# EAGLE design BantiPai_eYSIP22 (EAGLE 9.6.1)
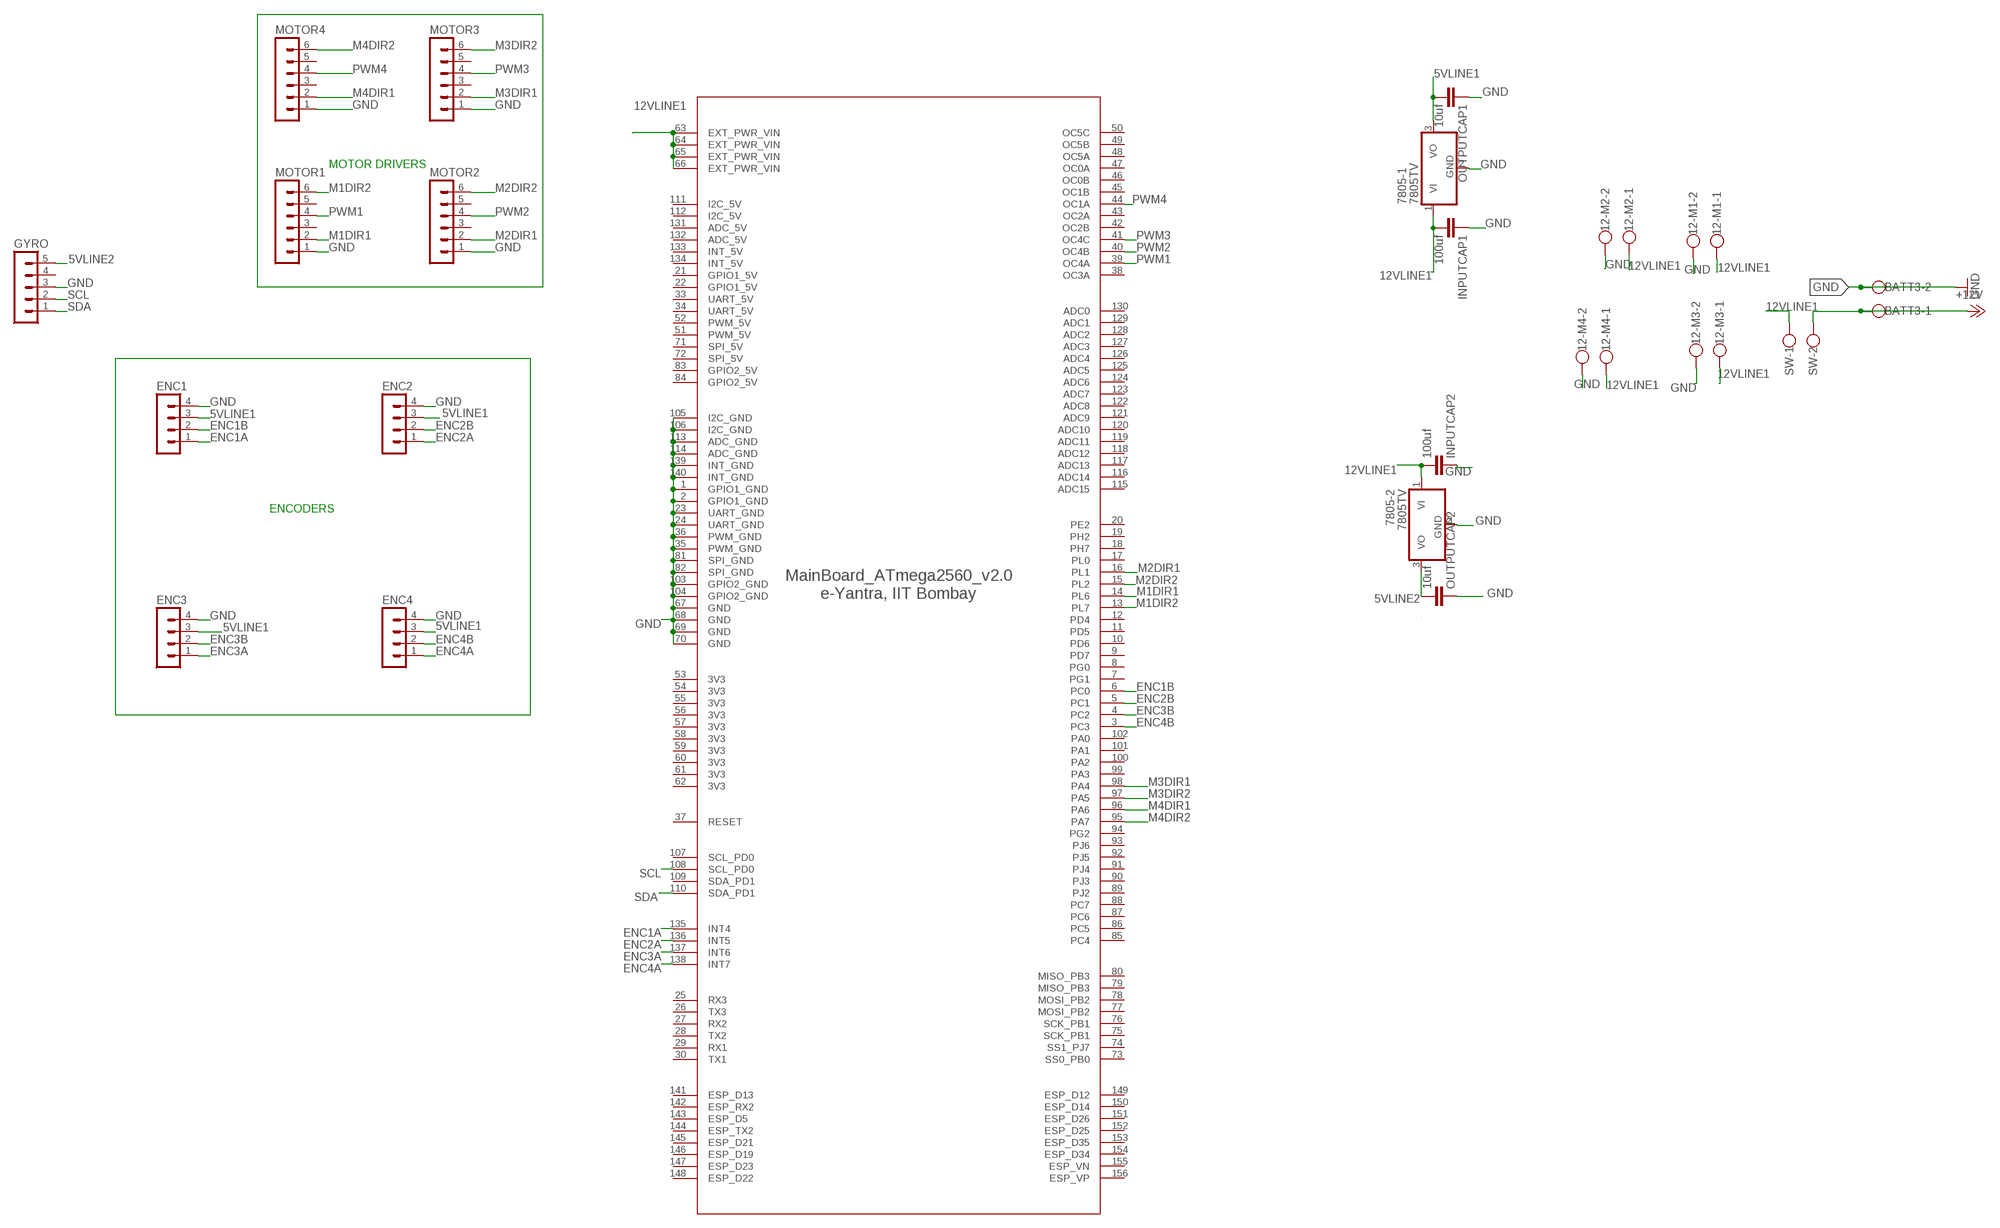
[diagram p0: schematic, sheet 1]

## Parts
12-M1  W237-102  [W237-102]
12-M2  W237-102  [W237-102]
12-M3  W237-102  [W237-102]
12-M4  W237-102  [W237-102]
7805-1  7805TV  [TO220V]
7805-2  7805TV  [TO220V]
BATT3  W237-102  [W237-102]
ENC1  MA04-1  [MA04-1]
ENC2  MA04-1  [MA04-1]
ENC3  MA04-1  [MA04-1]
ENC4  MA04-1  [MA04-1]
EYFI  ATMEGA2560_V2.0  [ATMEGA2560_V2.0]
GYRO  MA05-1  [MA05-1]
INPUTCAP1  100uf  C2.5/2  [C2.5-2]
INPUTCAP2  100uf  C2.5/2  [C2.5-2]
MOTOR1  MA06-1  [MA06-1]
MOTOR2  MA06-1  [MA06-1]
MOTOR3  MA06-1  [MA06-1]
MOTOR4  MA06-1  [MA06-1]
OUTPUTCAP1  10uf  C2.5/2  [C2.5-2]
OUTPUTCAP2  10uf  C2.5/2  [C2.5-2]
SW  W237-102  [W237-102]

## Nets
5VLINE1: 7805-1.3(VO) ENC1.3 ENC2.3 ENC3.3 ENC4.3 OUTPUTCAP1.2
5VLINE2: 7805-2.3(VO) GYRO.5 OUTPUTCAP2.2
12VLINE1 [twelvevolt]: 12-M1.1 12-M2.1 12-M3.1 12-M4.1 7805-1.1(VI) 7805-2.1(VI) EYFI.63(EXT_PWR_VIN) EYFI.64(EXT_PWR_VIN) EYFI.65(EXT_PWR_VIN) EYFI.66(EXT_PWR_VIN) INPUTCAP1.2 INPUTCAP2.2 SW.1
+12V: BATT3.1 SW.2
ENC1A: ENC1.1 EYFI.135(INT4)
ENC1B: ENC1.2 EYFI.6(PC0)
ENC2A: ENC2.1 EYFI.136(INT5)
ENC2B: ENC2.2 EYFI.5(PC1)
ENC3A: ENC3.1 EYFI.137(INT6)
ENC3B: ENC3.2 EYFI.4(PC2)
ENC4A: ENC4.1 EYFI.138(INT7)
ENC4B: ENC4.2 EYFI.3(PC3)
GND: 12-M1.2 12-M2.2 12-M3.2 12-M4.2 7805-1.2(GND) 7805-2.2(GND) BATT3.2 ENC1.4 ENC2.4 ENC3.4 ENC4.4 EYFI.1(GPIO1_GND) EYFI.2(GPIO1_GND) EYFI.23(UART_GND) EYFI.24(UART_GND) EYFI.35(PWM_GND) EYFI.36(PWM_GND) EYFI.67(GND) EYFI.68(GND) EYFI.69(GND) EYFI.70(GND) EYFI.81(SPI_GND) EYFI.82(SPI_GND) EYFI.103(GPIO2_GND) EYFI.104(GPIO2_GND) EYFI.105(I2C_GND) EYFI.106(I2C_GND) EYFI.113(ADC_GND) EYFI.114(ADC_GND) EYFI.139(INT_GND) EYFI.140(INT_GND) GYRO.3 INPUTCAP1.1 INPUTCAP2.1 MOTOR1.1 MOTOR2.1 MOTOR3.1 MOTOR4.1 OUTPUTCAP1.1 OUTPUTCAP2.1
M1DIR1: EYFI.14(PL6) MOTOR1.2
M1DIR2: EYFI.13(PL7) MOTOR1.6
M2DIR1: EYFI.16(PL1) MOTOR2.2
M2DIR2: EYFI.15(PL2) MOTOR2.6
M3DIR1: EYFI.98(PA4) MOTOR3.2
M3DIR2: EYFI.97(PA5) MOTOR3.6
M4DIR1: EYFI.96(PA6) MOTOR4.2
M4DIR2: EYFI.95(PA7) MOTOR4.6
PWM1: EYFI.39(OC4A) MOTOR1.4
PWM2: EYFI.40(OC4B) MOTOR2.4
PWM3: EYFI.41(OC4C) MOTOR3.4
PWM4: EYFI.44(OC1A) MOTOR4.4
SCL: EYFI.108(SCL_PD0) GYRO.2
SDA: EYFI.110(SDA_PD1) GYRO.1
Unconnected: EYFI.7(PG1) EYFI.8(PG0) EYFI.9(PD7) EYFI.10(PD6) EYFI.11(PD5) EYFI.12(PD4) EYFI.17(PL0) EYFI.18(PH7) EYFI.19(PH2) EYFI.20(PE2) EYFI.25(RX3) EYFI.26(TX3) EYFI.27(RX2) EYFI.28(TX2) EYFI.29(RX1) EYFI.30(TX1) EYFI.37(RESET) EYFI.38(OC3A) EYFI.42(OC2B) EYFI.43(OC2A) EYFI.45(OC1B) EYFI.46(OC0B) EYFI.47(OC0A) EYFI.48(OC5A) EYFI.49(OC5B) EYFI.50(OC5C) EYFI.73(SS0_PB0) EYFI.74(SS1_PJ7) EYFI.75(SCK_PB1) EYFI.76(SCK_PB1) EYFI.77(MOSI_PB2) EYFI.78(MOSI_PB2) EYFI.79(MISO_PB3) EYFI.80(MISO_PB3) EYFI.85(PC4) EYFI.86(PC5) EYFI.87(PC6) EYFI.88(PC7) EYFI.89(PJ2) EYFI.90(PJ3) EYFI.91(PJ4) EYFI.92(PJ5) EYFI.93(PJ6) EYFI.94(PG2) EYFI.99(PA3) EYFI.100(PA2) EYFI.101(PA1) EYFI.102(PA0) EYFI.107(SCL_PD0) EYFI.109(SDA_PD1) EYFI.115(ADC15) EYFI.116(ADC14) EYFI.117(ADC13) EYFI.118(ADC12) EYFI.119(ADC11) EYFI.120(ADC10) EYFI.121(ADC9) EYFI.122(ADC8) EYFI.123(ADC7) EYFI.124(ADC6) EYFI.125(ADC5) EYFI.126(ADC4) EYFI.127(ADC3) EYFI.128(ADC2) EYFI.129(ADC1) EYFI.130(ADC0) EYFI.141(ESP_D13) EYFI.142(ESP_RX2) EYFI.143(ESP_D5) EYFI.144(ESP_TX2) EYFI.145(ESP_D21) EYFI.146(ESP_D19) EYFI.147(ESP_D23) EYFI.148(ESP_D22) EYFI.149(ESP_D12) EYFI.150(ESP_D14) EYFI.151(ESP_D26) EYFI.152(ESP_D25) EYFI.153(ESP_D35) EYFI.154(ESP_D34) EYFI.155(ESP_VN) EYFI.156(ESP_VP) GYRO.4 MOTOR1.3 MOTOR1.5 MOTOR2.3 MOTOR2.5 MOTOR3.3 MOTOR3.5 MOTOR4.3 MOTOR4.5

## Notes on the sheet
- MOTOR DRIVERS
- ENCODERS

## Power pins joined to a net without a drawn wire
3V3: EYFI.53(3V3) EYFI.54(3V3) EYFI.55(3V3) EYFI.56(3V3) EYFI.57(3V3) EYFI.58(3V3) EYFI.59(3V3) EYFI.60(3V3) EYFI.61(3V3) EYFI.62(3V3)
ADC_5V: EYFI.131(ADC_5V) EYFI.132(ADC_5V)
GPIO1_5V: EYFI.21(GPIO1_5V) EYFI.22(GPIO1_5V)
GPIO2_5V: EYFI.83(GPIO2_5V) EYFI.84(GPIO2_5V)
I2C_5V: EYFI.111(I2C_5V) EYFI.112(I2C_5V)
INT_5V: EYFI.133(INT_5V) EYFI.134(INT_5V)
PWM_5V: EYFI.51(PWM_5V) EYFI.52(PWM_5V)
SPI_5V: EYFI.71(SPI_5V) EYFI.72(SPI_5V)
UART_5V: EYFI.33(UART_5V) EYFI.34(UART_5V)

## Library data of the parts
12-M1-12-M4 BATT3 SW = con-wago-500:W237-102: WAGO SCREW CLAMP; MPN: 237-102; OC_FARNELL: unknown; OC_NEWARK: 70K9898
7805-1 7805-2 = linear:78*: Positive VOLTAGE REGULATOR Source: http://cache.national.com/ds/LM/LM78L05.pdf http://www.fairchildsemi.com/ds/LM/LM7805.pdf
ENC1-ENC4 = con-lstb:MA04-1: PIN HEADER; OC_FARNELL: unknown; OC_NEWARK: unknown
EYFI = eYFi-Mega_v2.0.1:ATMEGA2560_V2.0
GYRO = con-lstb:MA05-1: PIN HEADER; OC_FARNELL: unknown; OC_NEWARK: unknown
INPUTCAP1 INPUTCAP2 OUTPUTCAP1 OUTPUTCAP2 = capacitor-wima:C: CAPACITOR naming: grid - package width
MOTOR1-MOTOR4 = con-lstb:MA06-1: PIN HEADER; OC_FARNELL: unknown; OC_NEWARK: unknown

## Net classes
0 default: width 0.7 mm, drill 0.508 mm, clearance 0.254 mm
1 New Class: width 1 mm, drill 0.508 mm, clearance 0.254 mm
2 twelvevolt: width 2 mm, drill 0.508 mm, clearance 0.254 mm

## Board
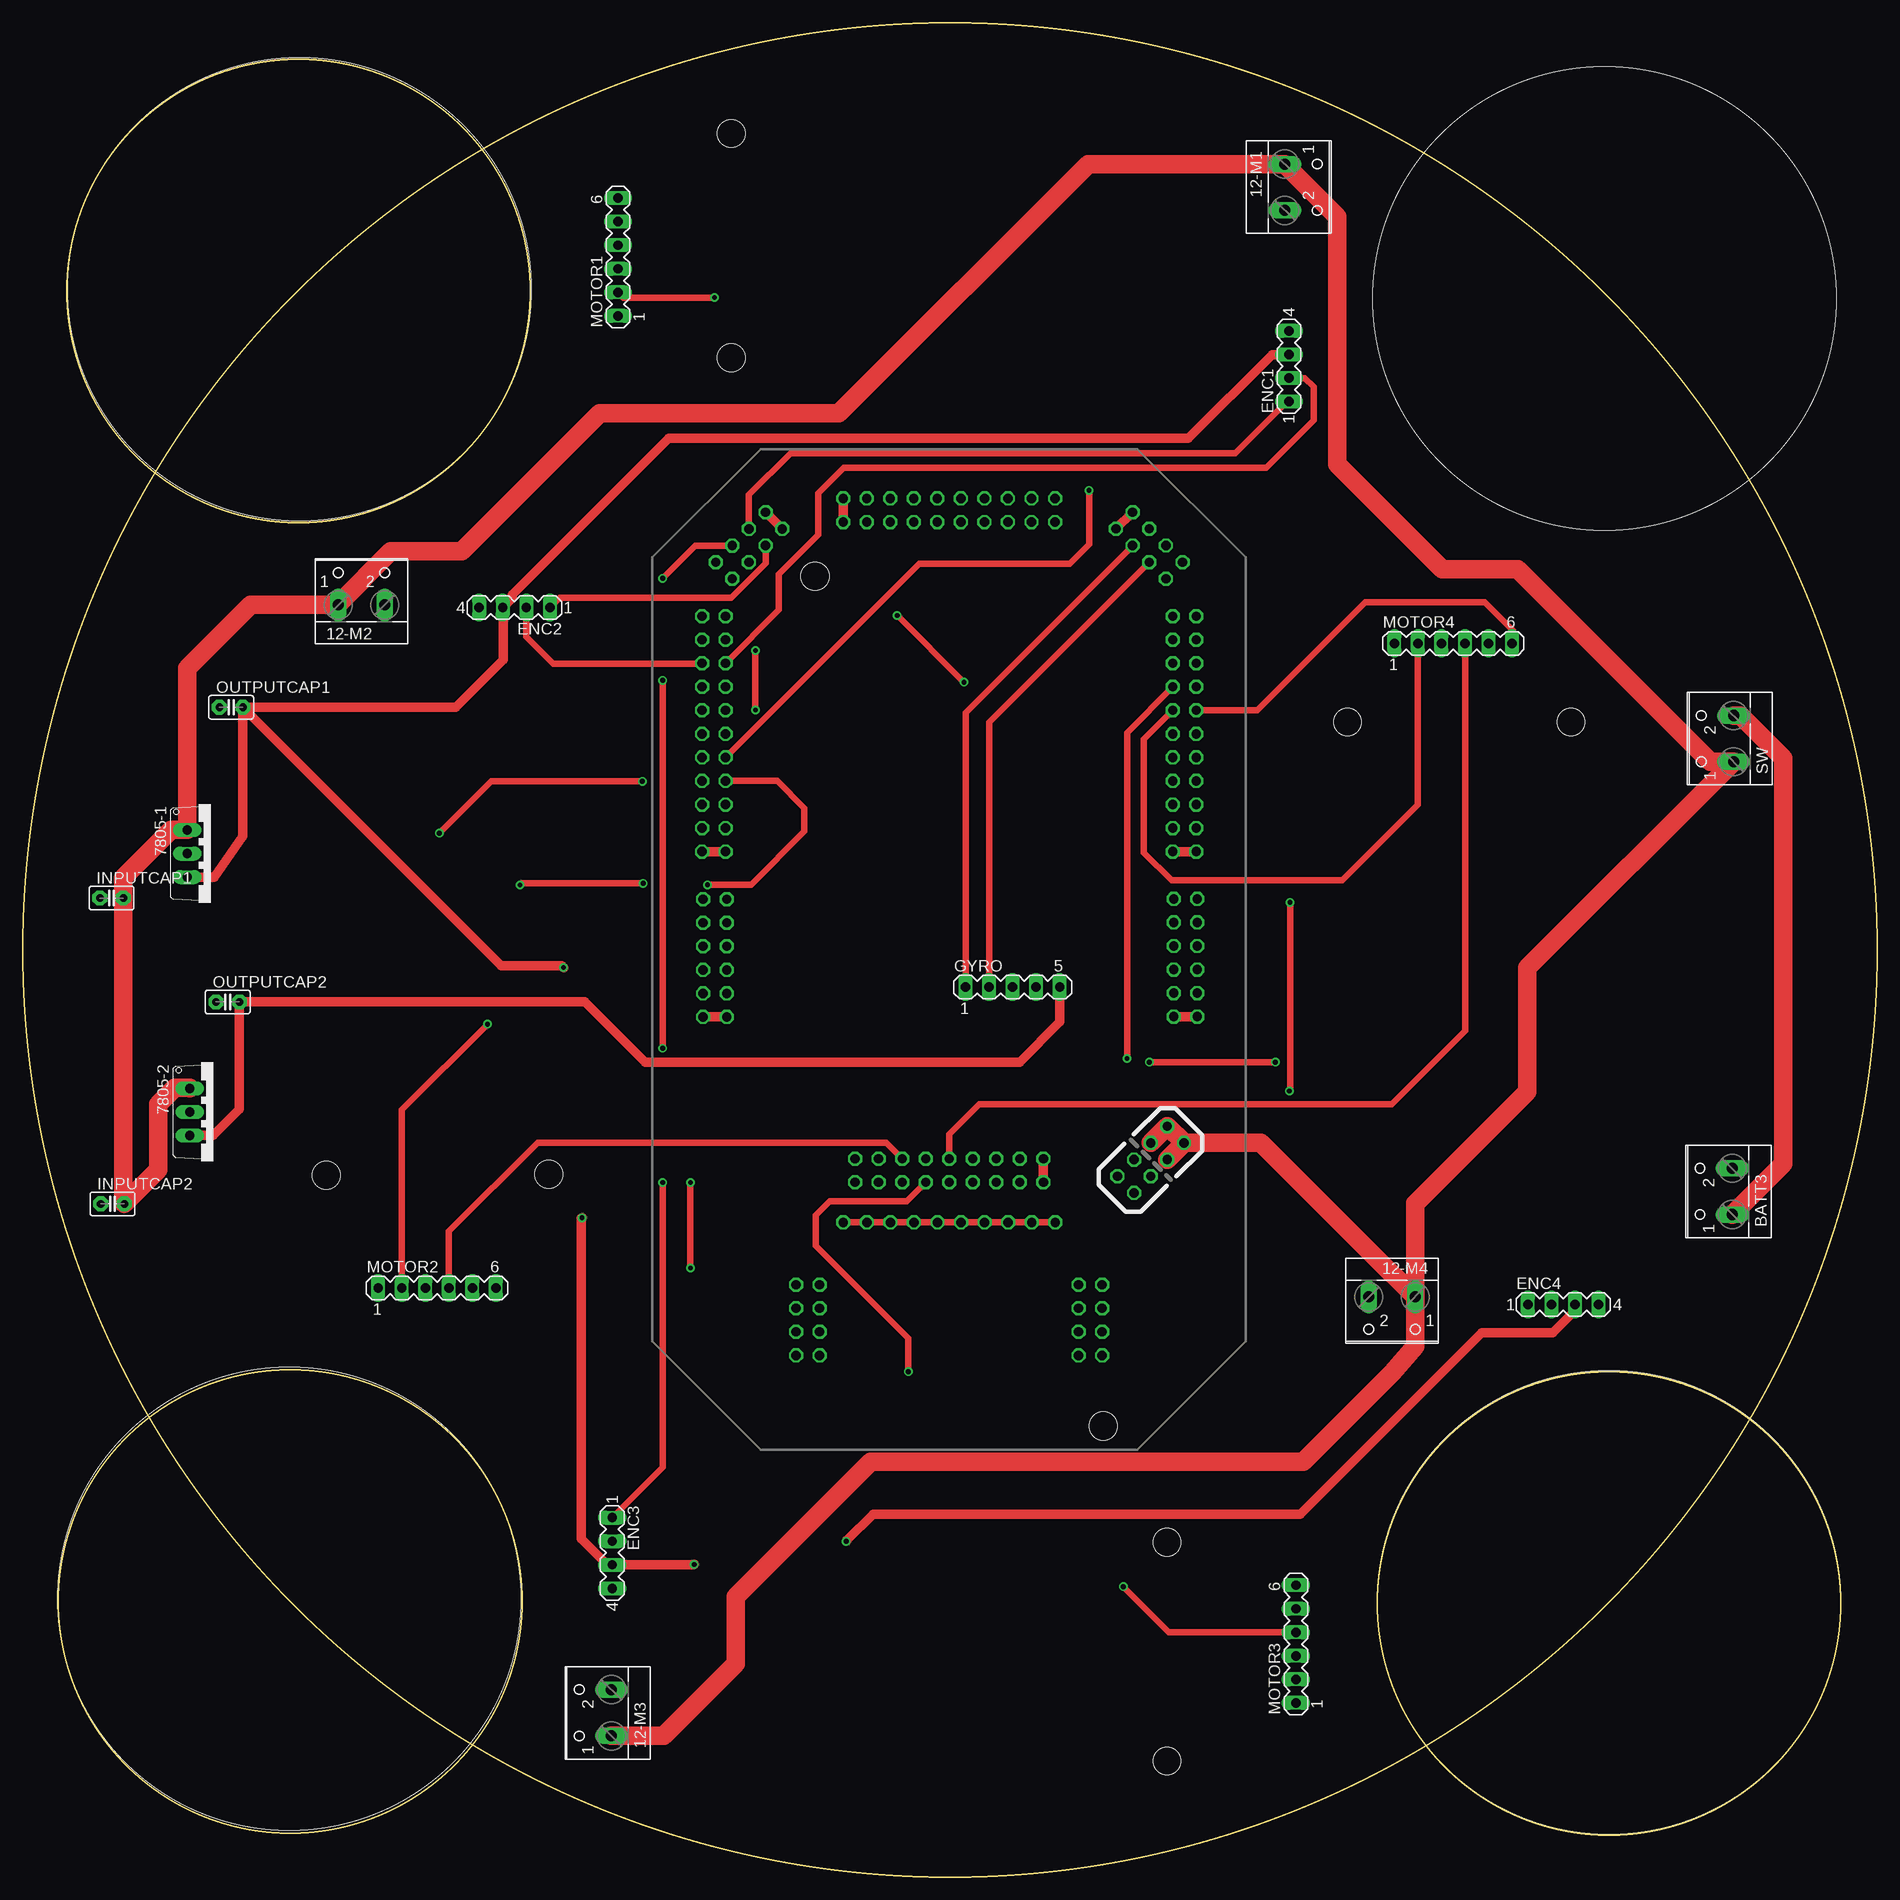
[diagram p1: board, top side]
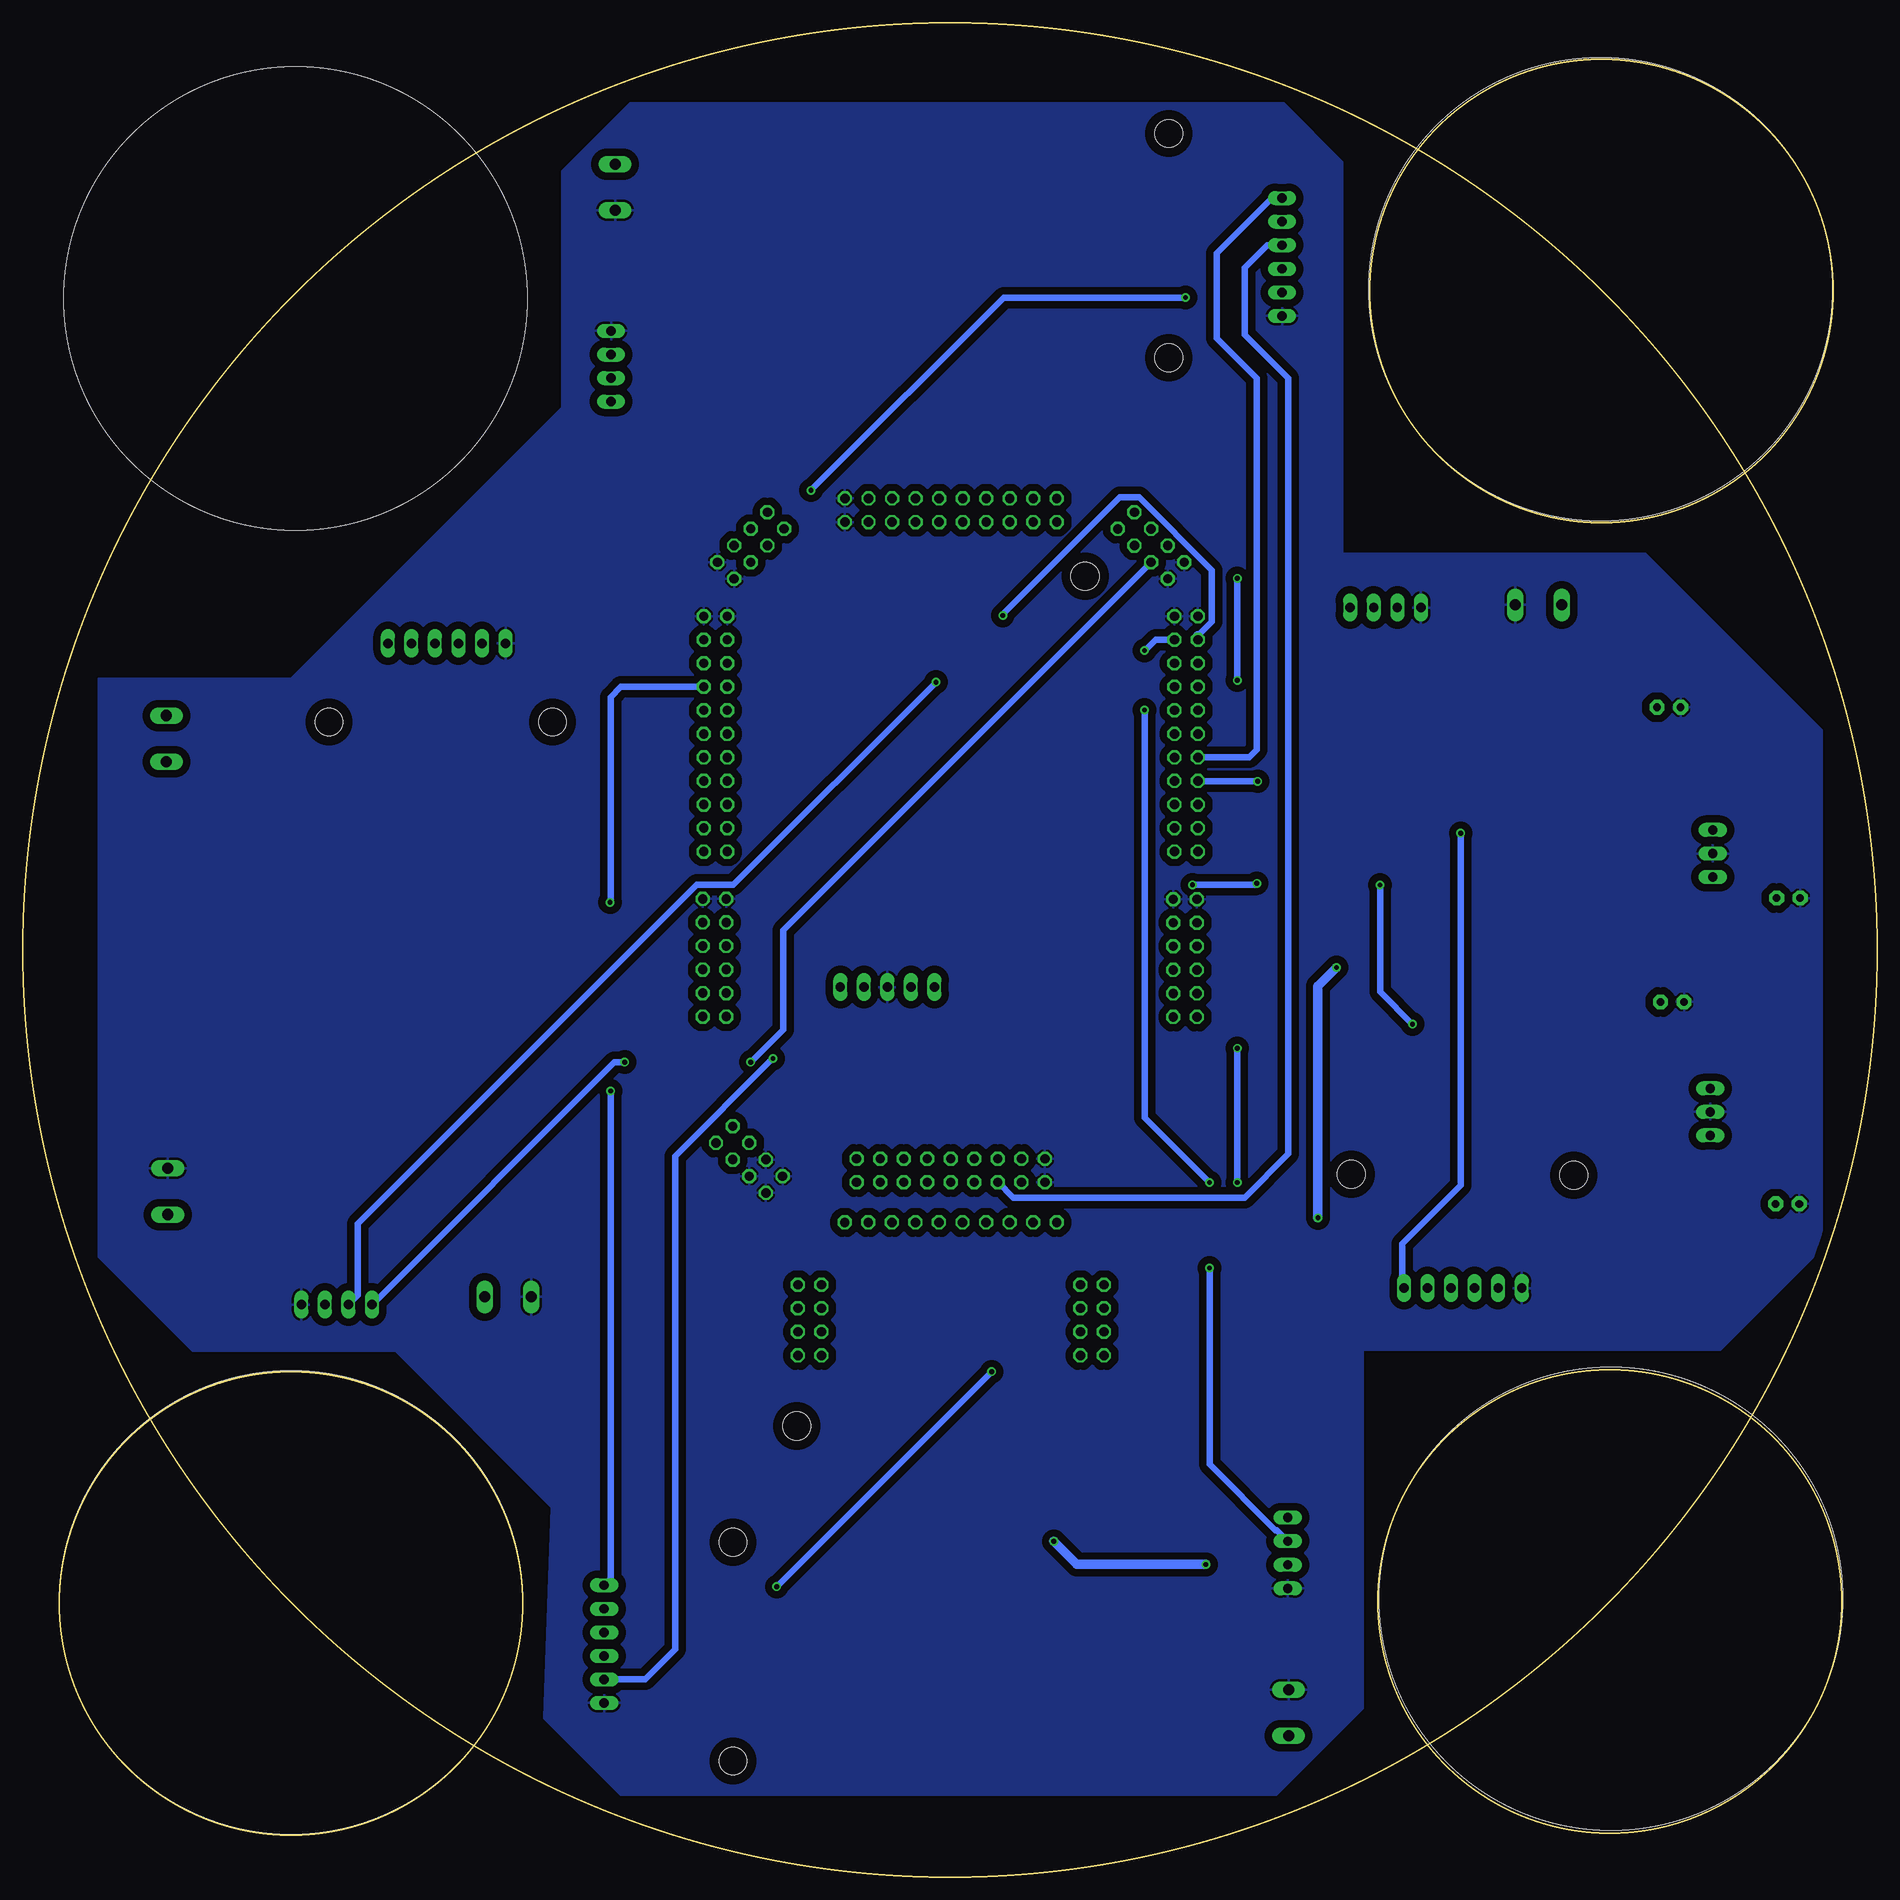
[diagram p2: board, bottom side, seen from below]

Size 200 x 200 mm. Coordinates in mm from the lower left corner, seen from the top.
Outline: circle at 100,100 radius 100
Outline: circle at 29.7,171.1 radius 25
Outline: circle at 28.8,29.7 radius 25
Outline: circle at 171.1,29.5 radius 25
Copper layers (1*16): Top 0.035mm / dielectric 1.5mm / Bottom 0.035mm
Design rules "default": minimum track width 6mil, minimum drill 0.35mm, track to track 6mil, track to pad 6mil, pad to pad 6mil, via to via 6mil, smd to smd 6mil, copper to edge 40mil, drill to drill 6mil, minimum pad ring 10mil, minimum via ring 8mil, stop-mask expansion 4mil, vias tented up to drill 0mil, thermal gap 10mil
Holes 50 mm at 170.6,170.3 29.8,171.3 28.7,30 171.1,29.6
Holes 3 mm at 142.9,124.6 167,124.6 32.7,75.7 56.7,75.8 76.4,188.1 76.4,163.9 123.4,36.1 123.4,12.5

### Footprints (pad centres in the part's own frame; a part is rotated, then mirrored left to right if it is on the bottom)
W237-102 = drill 1.194 long: 1 -2.5,-1.27; 2 2.5,-1.27
TO220V = drill 1.016 long: 1 -2.54,-2.54; 2 0,-2.54; 3 2.54,-2.54
MA04-1 = drill 1.016 long: 1 -3.81,0; 2 -1.27,0; 3 1.27,0; 4 3.81,0
ATMEGA2560_V2.0 = drill 1 octagon: 1 5.344,89.916; 2 7.884,89.916; 3 5.344,87.376; 4 7.884,87.376; 5 5.344,84.836; 6 7.884,84.836; 7 5.344,82.296; 8 7.884,82.296; 9 5.344,79.756; 10 7.884,79.756; 11 5.344,77.216; 12 7.884,77.216; 13 5.344,74.676; 14 7.884,74.676; 15 5.344,72.136; 16 7.884,72.136; 17 5.344,69.596; 18 7.884,69.596; 19 5.344,67.056; 20 7.884,67.056; 21 5.344,64.516; 22 7.884,64.516; 23 5.461,59.373; 24 8.001,59.373; 25 5.461,56.833; 26 8.001,56.833; 27 5.461,54.292; 28 8.001,54.292; 29 5.461,51.752; 30 8.001,51.752; 31 5.461,49.212; 32 8.001,49.212; 33 5.461,46.672; 34 8.001,46.672; 35 21.857,28.839; 36 21.857,31.379; 37 24.397,28.839; 38 24.397,31.379; 39 26.937,28.839; 40 26.937,31.379; 41 29.477,28.839; 42 29.477,31.379; 43 32.017,28.839; 44 32.017,31.379; 45 34.557,28.839; 46 34.557,31.379; 47 37.097,28.839; 48 37.097,31.379; 49 39.637,28.839; 50 39.637,31.379; 51 42.177,28.839; 52 42.177,31.379; 53 20.592,24.511; 54 23.132,24.511; 55 25.672,24.511; 56 28.212,24.511; 57 30.752,24.511; 58 33.292,24.511; 59 35.832,24.511; 60 38.372,24.511; 61 40.912,24.511; 62 43.452,24.511; 63 57.348,33.078; 64 55.552,34.874; 65 55.552,31.282; 66 53.756,33.078; 67 53.756,29.486; 68 51.96,31.282; 69 51.96,27.69; 70 50.164,29.486; 71 58.783,46.711; 72 56.243,46.711; 73 58.783,49.251; 74 56.243,49.251; 75 58.783,51.791; 76 56.243,51.791; 77 58.783,54.331; 78 56.243,54.331; 79 58.783,56.871; 80 56.243,56.871; 81 58.783,59.411; 82 56.243,59.411; 83 58.674,64.516; 84 56.134,64.516; 85 58.674,67.056; 86 56.134,67.056; 87 58.674,69.596; 88 56.134,69.596; 89 58.674,72.136; 90 56.134,72.136; 91 58.674,74.676; 92 56.134,74.676; 93 58.674,77.216; 94 56.134,77.216; 95 58.674,79.756; 96 56.134,79.756; 97 58.674,82.296; 98 56.134,82.296; 99 58.674,84.836; 100 56.134,84.836; 101 58.674,87.376; 102 56.134,87.376; 103 58.674,89.916; 104 56.134,89.916; 105 57.192,95.746; 106 55.396,93.95; 107 55.396,97.542; 108 53.6,95.746; 109 53.6,99.338; 110 51.804,97.542; 111 51.804,101.135; 112 50.008,99.338; 113 43.434,102.616; 114 43.434,100.076; 115 40.894,102.616; 116 40.894,100.076; 117 38.354,102.616; 118 38.354,100.076; 119 35.814,102.616; 120 35.814,100.076; 121 33.274,102.616; 122 33.274,100.076; 123 30.734,102.616; 124 30.734,100.076; 125 28.194,102.616; 126 28.194,100.076; 127 25.654,102.616; 128 25.654,100.076; 129 23.114,102.616; 130 23.114,100.076; 131 20.574,102.616; 132 20.574,100.076; 133 12.208,101.133; 134 14.004,99.337; 135 10.411,99.337; 136 12.208,97.541; 137 8.615,97.541; 138 10.411,95.745; 139 6.819,95.745; 140 8.615,93.949; 141 15.494,17.78; 142 18.034,17.78; 143 15.494,15.24; 144 18.034,15.24; 145 15.494,12.7; 146 18.034,12.7; 147 15.494,10.16; 148 18.034,10.16; 149 45.974,17.78; 150 48.514,17.78; 151 45.974,15.24; 152 48.514,15.24; 153 45.974,12.7; 154 48.514,12.7; 155 45.974,10.16; 156 48.514,10.16 | hole 3.048: 17.526,94.234; 48.641,2.54
MA05-1 = drill 1.016 long: 1 -5.08,0; 2 -2.54,0; 3 0,0; 4 2.54,0; 5 5.08,0
C2.5-2 = drill 0.813 pad 1.6 octagon: 1 -1.27,0; 2 1.27,0
MA06-1 = drill 1.016 long: 1 -6.35,0; 2 -3.81,0; 3 -1.27,0; 4 1.27,0; 5 3.81,0; 6 6.35,0

### Placement (x,y rotation side)
12-M1  137.4,182.3 270 top
12-M2  36.5,138.5 0 top
12-M3  62.2,17.7 90 top
12-M4  147.7,61.3 180 top
7805-1  20.24,110.41 270 top
7805-2  20.51,82.53 270 top
BATT3  183.13,73.96 90 top
ENC1  136.56,162.98 90 top
ENC2  53.01,136.94 180 top
ENC3  63.56,34.94 270 top
ENC4  166.17,61.74 0 top
EYFI  67.9,46.1 0 top
GYRO  106.76,95.99 0 top
INPUTCAP1  9.54,105.61 0 top
INPUTCAP2  9.64,72.61 0 top
MOTOR1  64.17,174.77 90 top
MOTOR2  44.66,63.53 0 top
MOTOR3  137.31,25.11 90 top
MOTOR4  154.3,133.09 0 top
OUTPUTCAP1  22.44,126.19 0 top
OUTPUTCAP2  22.07,94.39 0 top
SW  183.27,122.8 90 top

### Tracks (layer width: path | path; a pad name or v marks a point on that pad's centre or on a via)
3V3
  Top 0.7: EYFI.53 EYFI.54 EYFI.55 EYFI.56 EYFI.57 EYFI.58 EYFI.59 EYFI.60 EYFI.61 EYFI.62
5VLINE1  (via drill 0.51)
  Top 1: OUTPUTCAP1.2 23.71,112.3 20.62,107.87 7805-1.3 | ENC1.3 134.75,164.25 125.7,155.2 69.63,155.2 52.76,138.33 52.76,137.96 ENC2.3 51.8,136.88 51.8,131.3 46.69,126.19 OUTPUTCAP1.2 | ENC4.3 167.44,61.14 165.02,58.72 157.37,58.72 137.76,39.12 91.7,39.12 88.88,36.3 88.88,36.28 v88.8,36.2 | OUTPUTCAP1.2 51.6,98.3 58.1,98.3 v58.3,98.1 | v60.3,71.1 60.24,71.04 60.24,36.46 63.3,33.41 ENC3.3 72.37,33.67 v72.4,33.7
  Bottom 1: v88.8,36.2 86.3,33.7 v72.4,33.7 | v58.3,98.1 60.3,96.1 v60.3,71.1
5VLINE2
  Top 1: 7805-2.3 20.49,79.99 23.34,82.84 OUTPUTCAP2.2 60.61,94.39 67.1,87.9 107.5,87.9 111.84,92.24 GYRO.5
12VLINE1
  Top 2: 12-M4.1 145.47,67.3 145.5,67.23 133.55,79.18 EYFI.63 | 12-M3.1 69.1,15.2 76.9,23 76.9,30.23 91.47,44.8 138.1,44.8 147.7,54.4 150.2,57.27 12-M4.1 | 12-M4.1 150.2,72.68 150.3,72.73 162.3,84.73 162.3,98.06 SW.1 182.04,120.3 161.26,141.08 153.12,141.08 141.8,152.4 141.8,179.13 12-M1.1 114.9,184.8 88,157.9 62.2,157.9 47.3,143 39.67,143 34,137.33 12-M2.1 24.53,137.23 17.7,130.4 7805-1.1 15.95,112.95 10.81,107.81 INPUTCAP1.2 10.81,72.71 INPUTCAP2.2 14.59,76.29 14.59,83.36 16.37,85.15 17.97,85.15 7805-2.1 | EYFI.63 EYFI.65 | EYFI.65 | EYFI.63 EYFI.64 EYFI.66 | EYFI.66
+12V
  Top 2: BATT3.1 189.9,76.96 189.9,120.7 185.3,125.3 SW.2
ADC_5V
  Top 1: EYFI.131 EYFI.132
ENC1A
  Top 0.7: ENC1.1 136.36,159.17 130.79,153.6 82.8,153.6 78.31,149.11 EYFI.135
ENC1B
  Top 0.7: ENC1.2 138.29,161.71 139.24,160.76 139.24,157.14 134.14,152.05 88.55,152.05 85.8,149.3 85.8,144.8 81.54,140.53 81.54,136.69 EYFI.6
ENC2A
  Top 0.7: ENC2.1 57.87,137.99 76.38,137.99 80.11,141.72 EYFI.136
ENC2B
  Top 0.7: ENC2.2 54.28,133.82 57.2,130.9 73.21,130.9 EYFI.5
ENC3A  (via drill 0.51)
  Top 0.7: EYFI.137 76.47,143.6 72.5,143.6 v69,140.1 | v69,129.1 v69,89.4 | v69,74.9 69,44.19 ENC3.1
  Bottom 0.7: v69,140.1 v69,129.1 | v69,89.4 v69,74.9
ENC3B  (via drill 0.51)
  Top 0.7: v72,74.9 v72,65.7 | v79,132.3 v79,125.9
  Bottom 0.7: EYFI.4 77.82,133.48 v79,132.3 | v72,74.9 79,81.9 v79,125.9 | ENC3.2 64.73,37.38 64.89,37.38 72,44.5 v72,65.7
ENC4A  (via drill 0.51)
  Top 0.7: v121.5,87.9 v135.1,87.9
  Bottom 0.7: EYFI.138 118,102.16 118,91.4 v121.5,87.9 | v135.1,87.9 136.2,87.9 ENC4.1
ENC4B  (via drill 0.51)
  Top 0.7: v94.3,136.1 v101.5,128.9
  Bottom 0.7: ENC4.2 163.88,62.76 163.88,70.45 127.31,107.02 123.38,107.02 v101.5,128.9 | 73.24,133.88 71.74,135.39 71.74,140.99 79.58,148.84 81.7,148.84 94.3,136.24 v94.3,136.1
  Bottom 1: 73.24,133.88 EYFI.3
GND
  pour Bottom (isolate 0.8): 5.9,67.8 5.9,123.7 25,142.8 57.6,142.8 57.6,185 64,191.4 134.5,191.4 141.9,184 141.9,158.5 171.1,129.3 191.9,129.3 191.9,66.9 181.7,56.7 159.8,56.7 143,39.9 143.82,17.12 135.5,8.8 64.8,8.8 55.4,18.2 55.4,56.8 16.9,56.8
GPIO1_5V
  Top 1: EYFI.21 EYFI.22
GPIO2_5V
  Top 1: EYFI.84 EYFI.83
I2C_5V
  Top 1: EYFI.112 EYFI.111 | EYFI.111
INT_5V
  Top 1: EYFI.133 EYFI.134 | EYFI.134
M1DIR1  (via drill 0.51)
  Top 0.7: v115,149.6 115,143.8 112.9,141.7 96.71,141.7 EYFI.14 | v74.6,170.4 64.73,170.4 MOTOR1.2
  Bottom 0.7: v115,149.6 94.2,170.4 v74.6,170.4
M1DIR2
  Bottom 0.7: MOTOR1.6 65.28,181.12 71.2,175.2 71.2,166 66.9,161.7 66.9,121.6 67.72,120.78 EYFI.13
M2DIR1  (via drill 0.51)
  Top 0.7: MOTOR2.2 40.85,82.75 v50.1,92 | v53.6,107 53.8,107.2 v66.9,107.2 | v73.85,107.04 78.54,107.04 84.3,112.8 84.3,115.3 81.36,118.24 EYFI.16
  Bottom 0.7: v50.1,92 53.6,95.5 v53.6,107 | v73.85,107.04 67.06,107.04 v66.9,107.2
M2DIR2  (via drill 0.51)
  Top 0.7: v66.8,118.2 50.5,118.2 v44.9,112.6
  Bottom 0.7: EYFI.15 73.21,118.2 v66.8,118.2 | v44.9,112.6 44.9,74.6 51.2,68.3 51.2,63.72 MOTOR2.6
M3DIR1  (via drill 0.51)
  Top 0.7: 119.1,90.8 | 119.1,90.8 v119.1,88.3 | EYFI.98 119.1,123.46 119.1,90.8
  Bottom 0.7: MOTOR3.2 132.9,21.3 129.65,24.55 129.65,77.75 v119.1,88.3
M3DIR2  (via drill 0.51)
  Top 0.7: v136.69,105.14 136.69,85.61 136.7,85.6 136.7,84.89 v136.61,84.8
  Bottom 0.7: EYFI.97 135.5,128.4 136.61,127.29 136.61,105.07 v136.69,105.14 | v136.61,84.8 136.61,32.16 MOTOR3.6
M4DIR1
  Top 0.7: MOTOR4.2 150.49,115.69 142.3,107.5 123.9,107.5 120.9,110.5 120.9,122.72 EYFI.96
M4DIR2
  Top 0.7: EYFI.95 133.16,125.86 144.8,137.5 157.7,137.5 160.7,134.5 160.7,133.14 MOTOR4.6
PWM1
  Bottom 0.7: EYFI.39 94.82,74.94 93.16,73.28 68.22,73.28 63.5,78 63.5,161.7 68.2,166.4 68.2,173.6 65.76,176.04 MOTOR1.4
PWM2
  Top 0.7: EYFI.40 | EYFI.40 93.12,79.2 55.5,79.2 45.93,69.63 MOTOR2.4
PWM3  (via drill 0.51)
  Top 0.7: v95.5,54.5 95.5,56 95.49,56.01 95.49,56.24 95.5,56.25 95.5,58.1 85.5,68.1 85.5,71.4 87,72.9 95.34,72.9 EYFI.41 | MOTOR3.4 123.62,26.38 v118.7,31.3
  Bottom 0.7: v118.7,31.3 v95.5,54.5
PWM4
  Top 0.7: MOTOR4.4 155.57,91.27 147.65,83.35 103.15,83.35 99.92,80.12 EYFI.44
PWM_5V
  Top 1: EYFI.52 EYFI.51
SCL
  Top 0.7: GYRO.2 104.22,124.57 EYFI.108
SDA
  Top 0.7: GYRO.1 101.68,125.62 EYFI.110
SPI_5V
  Top 1: EYFI.72 EYFI.71
UART_5V
  Top 1: EYFI.33 EYFI.34

### Text on the board
Document: EYSIP BANTIPAI